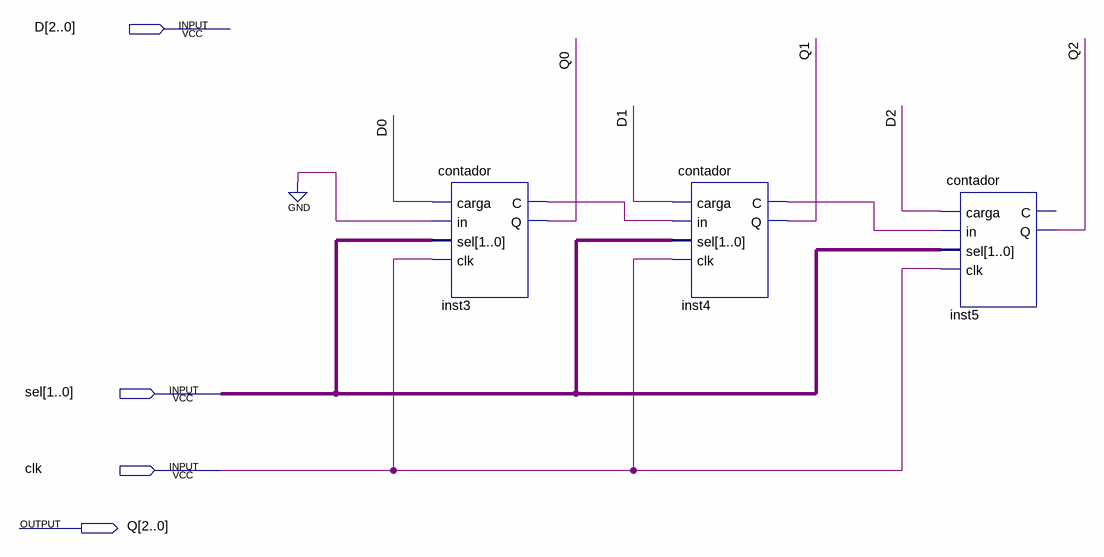
[diagram p0: schematic sheet]
// Quartus schematic contador_3bits.bdf as structural Verilog: 3 symbols, 4 pins
module contador_3bits (
  input  [2:0] D,
  input  [1:0] sel,
  input  clk,
  output [2:0] Q
);

  wire inst3_c, inst4_c;

  contador inst3 (.carga(D[0]), .in(1'b0), .sel(sel), .clk(clk), .C(inst3_c), .Q(Q[0]));
  contador inst4 (.carga(D[1]), .in(inst3_c), .sel(sel), .clk(clk), .C(inst4_c), .Q(Q[1]));
  contador inst5 (.carga(D[2]), .in(inst4_c), .sel(sel), .clk(clk), .Q(Q[2]));  // open: C
endmodule
